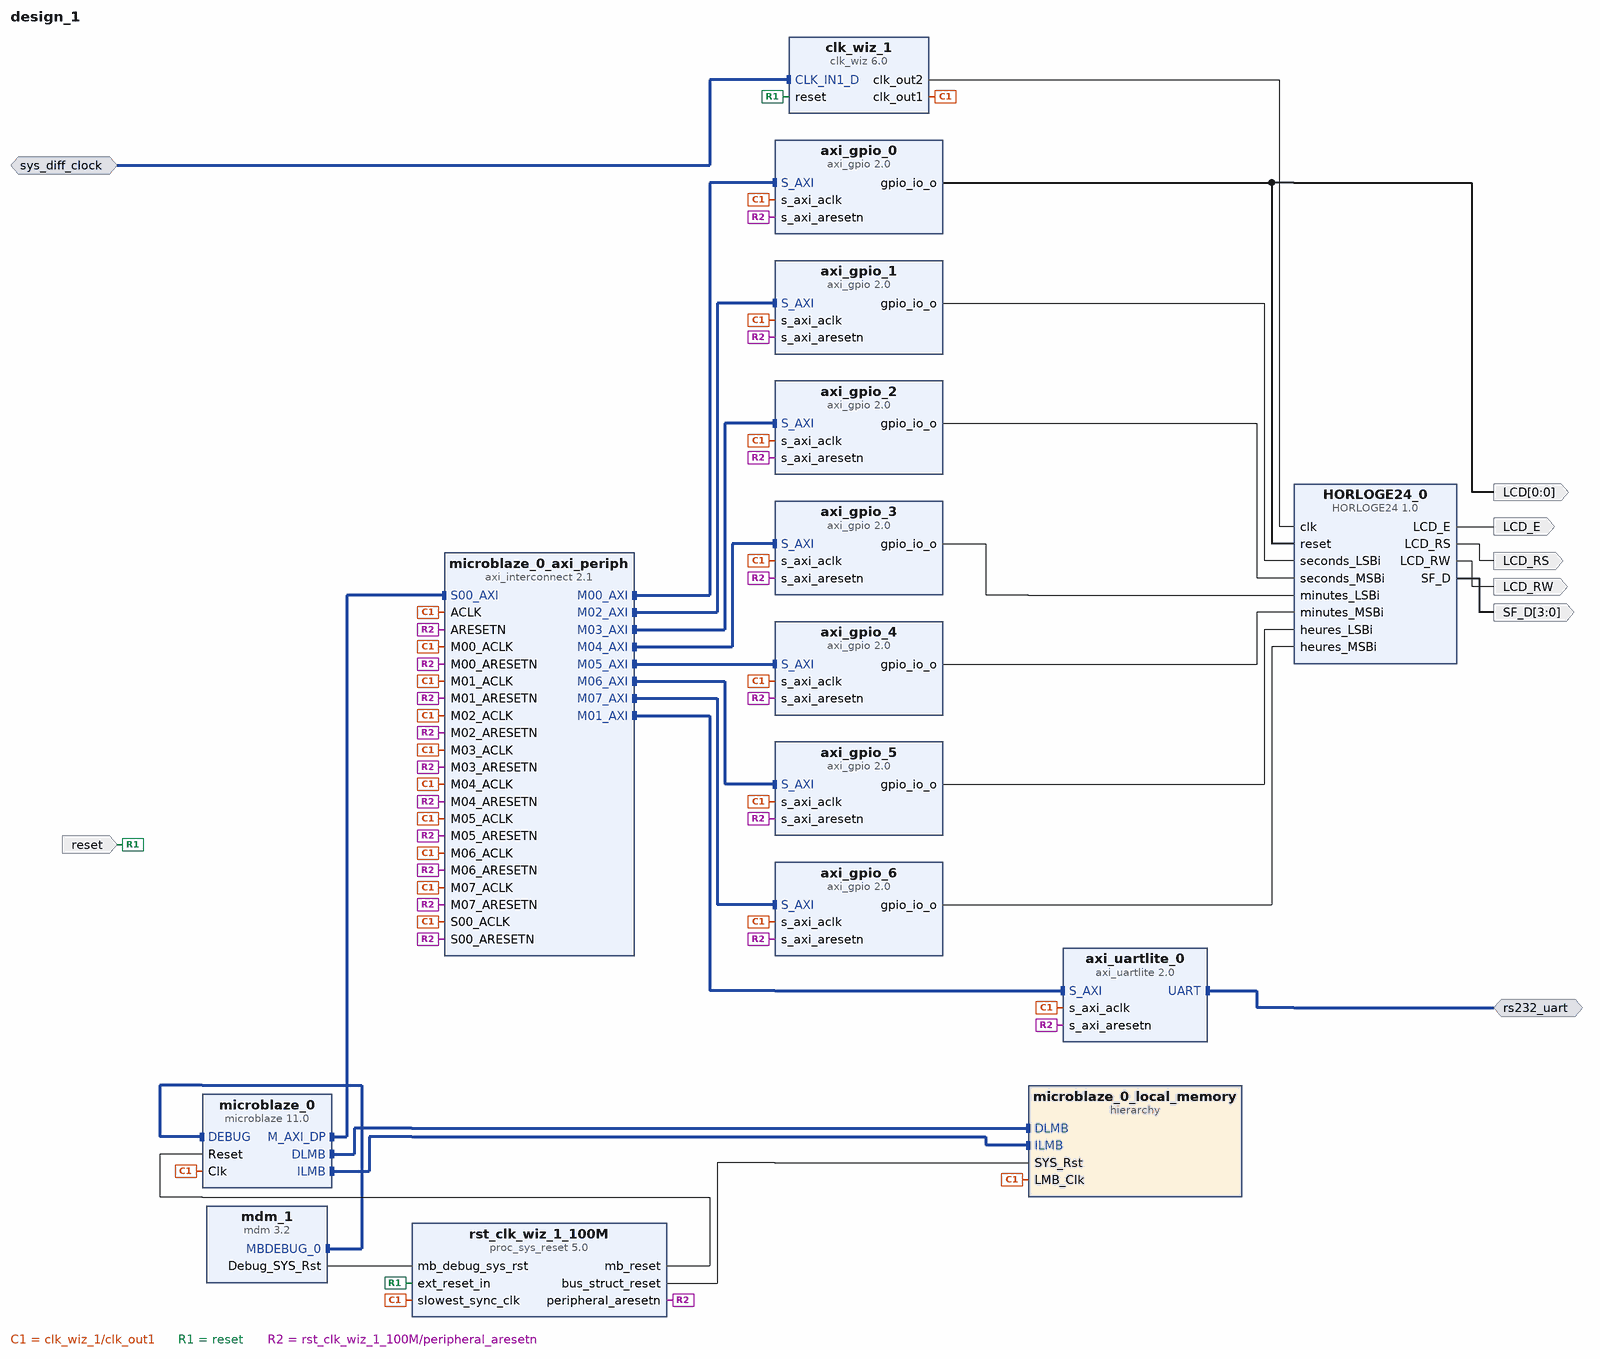
[diagram p0: block diagram of the top level]
# Vivado block design design_1, xc7k325tffg900-2, Vivado 2021.2
create_bd_design design_1

create_bd_intf_port -mode Master -vlnv xilinx.com:interface:uart_rtl:1.0 rs232_uart
create_bd_intf_port -mode Slave -vlnv xilinx.com:interface:diff_clock_rtl:1.0 sys_diff_clock
set_property -dict {CONFIG.FREQ_HZ 200000000} [get_bd_intf_ports sys_diff_clock]
create_bd_port -dir I -type rst reset
set_property -dict {CONFIG.POLARITY ACTIVE_HIGH} [get_bd_ports reset]
create_bd_port -dir O -from 0 -to 0 LCD
create_bd_port -dir O -from 3 -to 0 SF_D
create_bd_port -dir O LCD_E
create_bd_port -dir O LCD_RS
create_bd_port -dir O LCD_RW

create_bd_cell -type ip -vlnv xilinx.com:ip:microblaze:11.0 microblaze_0
set_property -dict [list \
  CONFIG.C_DEBUG_ENABLED 1 \
  CONFIG.C_D_AXI 1 \
  CONFIG.C_D_LMB 1 \
  CONFIG.C_I_LMB 1 \
  CONFIG.G_TEMPLATE_LIST 8 \
] [get_bd_cells microblaze_0]
create_bd_cell -type ip -vlnv xilinx.com:ip:axi_uartlite:2.0 axi_uartlite_0
set_property -dict {CONFIG.UARTLITE_BOARD_INTERFACE rs232_uart CONFIG.USE_BOARD_FLOW true} [get_bd_cells axi_uartlite_0]
create_bd_cell -type ip -vlnv xilinx.com:ip:axi_gpio:2.0 axi_gpio_0
set_property -dict {CONFIG.C_ALL_OUTPUTS 1 CONFIG.C_GPIO_WIDTH 1} [get_bd_cells axi_gpio_0]
create_bd_cell -type hier microblaze_0_local_memory
create_bd_cell -type ip -vlnv xilinx.com:ip:mdm:3.2 mdm_1
create_bd_cell -type ip -vlnv xilinx.com:ip:clk_wiz:6.0 clk_wiz_1
set_property -dict [list \
  CONFIG.CLKOUT2_JITTER 129.198 \
  CONFIG.CLKOUT2_PHASE_ERROR 89.971 \
  CONFIG.CLKOUT2_REQUESTED_OUT_FREQ 50 \
  CONFIG.CLKOUT2_USED true \
  CONFIG.CLK_IN1_BOARD_INTERFACE sys_diff_clock \
  CONFIG.MMCM_CLKOUT1_DIVIDE 20 \
  CONFIG.NUM_OUT_CLKS 2 \
  CONFIG.PRIM_SOURCE Differential_clock_capable_pin \
  CONFIG.RESET_BOARD_INTERFACE reset \
  CONFIG.USE_BOARD_FLOW true \
  CONFIG.USE_LOCKED false \
] [get_bd_cells clk_wiz_1]
create_bd_cell -type ip -vlnv xilinx.com:ip:proc_sys_reset:5.0 rst_clk_wiz_1_100M
set_property -dict {CONFIG.RESET_BOARD_INTERFACE reset CONFIG.USE_BOARD_FLOW true} [get_bd_cells rst_clk_wiz_1_100M]
create_bd_cell -type ip -vlnv xilinx.com:ip:axi_interconnect:2.1 microblaze_0_axi_periph
set_property -dict {CONFIG.NUM_MI 8} [get_bd_cells microblaze_0_axi_periph]
create_bd_cell -type ip -vlnv xilinx.com:ip:axi_gpio:2.0 axi_gpio_1
set_property -dict {CONFIG.C_ALL_OUTPUTS 1 CONFIG.C_GPIO_WIDTH 4} [get_bd_cells axi_gpio_1]
create_bd_cell -type ip -vlnv xilinx.com:ip:axi_gpio:2.0 axi_gpio_2
set_property -dict {CONFIG.C_ALL_OUTPUTS 1 CONFIG.C_GPIO_WIDTH 4} [get_bd_cells axi_gpio_2]
create_bd_cell -type ip -vlnv xilinx.com:ip:axi_gpio:2.0 axi_gpio_3
set_property -dict {CONFIG.C_ALL_OUTPUTS 1 CONFIG.C_GPIO_WIDTH 4} [get_bd_cells axi_gpio_3]
create_bd_cell -type ip -vlnv xilinx.com:ip:axi_gpio:2.0 axi_gpio_4
set_property -dict {CONFIG.C_ALL_OUTPUTS 1 CONFIG.C_GPIO_WIDTH 4} [get_bd_cells axi_gpio_4]
create_bd_cell -type ip -vlnv xilinx.com:ip:axi_gpio:2.0 axi_gpio_5
set_property -dict {CONFIG.C_ALL_OUTPUTS 1 CONFIG.C_GPIO_WIDTH 4} [get_bd_cells axi_gpio_5]
create_bd_cell -type ip -vlnv xilinx.com:ip:axi_gpio:2.0 axi_gpio_6
set_property -dict {CONFIG.C_ALL_OUTPUTS 1 CONFIG.C_GPIO_WIDTH 4} [get_bd_cells axi_gpio_6]
create_bd_cell -type ip -vlnv in2p3.fr:user:HORLOGE24:1.0 HORLOGE24_0

# ---- hierarchy /microblaze_0_local_memory ----
current_bd_instance /microblaze_0_local_memory
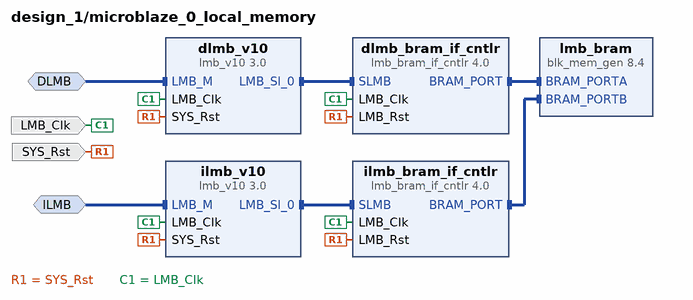
[diagram p1: block diagram inside /microblaze_0_local_memory]
create_bd_intf_pin -mode MirroredMaster -vlnv xilinx.com:interface:lmb_rtl:1.0 DLMB
create_bd_intf_pin -mode MirroredMaster -vlnv xilinx.com:interface:lmb_rtl:1.0 ILMB
create_bd_pin -dir I -type clk LMB_Clk
create_bd_pin -dir I -type rst SYS_Rst

create_bd_cell -type ip -vlnv xilinx.com:ip:lmb_v10:3.0 dlmb_v10
create_bd_cell -type ip -vlnv xilinx.com:ip:lmb_v10:3.0 ilmb_v10
create_bd_cell -type ip -vlnv xilinx.com:ip:lmb_bram_if_cntlr:4.0 dlmb_bram_if_cntlr
set_property -dict {CONFIG.C_ECC 0} [get_bd_cells dlmb_bram_if_cntlr]
create_bd_cell -type ip -vlnv xilinx.com:ip:lmb_bram_if_cntlr:4.0 ilmb_bram_if_cntlr
set_property -dict {CONFIG.C_ECC 0} [get_bd_cells ilmb_bram_if_cntlr]
create_bd_cell -type ip -vlnv xilinx.com:ip:blk_mem_gen:8.4 lmb_bram
set_property -dict {CONFIG.Memory_Type True_Dual_Port_RAM CONFIG.use_bram_block BRAM_Controller} [get_bd_cells lmb_bram]

# ---- connections ----

current_bd_instance /microblaze_0_local_memory
connect_bd_intf_net -intf_net microblaze_0_dlmb [get_bd_intf_pins DLMB] [get_bd_intf_pins dlmb_v10/LMB_M]
connect_bd_intf_net -intf_net microblaze_0_dlmb_bus [get_bd_intf_pins dlmb_v10/LMB_Sl_0] [get_bd_intf_pins dlmb_bram_if_cntlr/SLMB]
connect_bd_intf_net -intf_net microblaze_0_dlmb_cntlr [get_bd_intf_pins dlmb_bram_if_cntlr/BRAM_PORT] [get_bd_intf_pins lmb_bram/BRAM_PORTA]
connect_bd_intf_net -intf_net microblaze_0_ilmb [get_bd_intf_pins ILMB] [get_bd_intf_pins ilmb_v10/LMB_M]
connect_bd_intf_net -intf_net microblaze_0_ilmb_bus [get_bd_intf_pins ilmb_v10/LMB_Sl_0] [get_bd_intf_pins ilmb_bram_if_cntlr/SLMB]
connect_bd_intf_net -intf_net microblaze_0_ilmb_cntlr [get_bd_intf_pins ilmb_bram_if_cntlr/BRAM_PORT] [get_bd_intf_pins lmb_bram/BRAM_PORTB]
connect_bd_net [get_bd_pins SYS_Rst] \
  [get_bd_pins dlmb_v10/SYS_Rst] [get_bd_pins dlmb_bram_if_cntlr/LMB_Rst] [get_bd_pins ilmb_v10/SYS_Rst] \
  [get_bd_pins ilmb_bram_if_cntlr/LMB_Rst]
connect_bd_net -net microblaze_0_Clk [get_bd_pins LMB_Clk] \
  [get_bd_pins dlmb_v10/LMB_Clk] [get_bd_pins dlmb_bram_if_cntlr/LMB_Clk] [get_bd_pins ilmb_v10/LMB_Clk] \
  [get_bd_pins ilmb_bram_if_cntlr/LMB_Clk]
set_property HDL_ATTRIBUTE.BMM_INFO_ADDRESS_SPACE {byte  0x00000000 32 > design_1 microblaze_0_local_memory/lmb_bram} [get_bd_cells dlmb_bram_if_cntlr]
set_property HDL_ATTRIBUTE.KEEP_HIERARCHY yes [get_bd_cells dlmb_bram_if_cntlr]

current_bd_instance /
connect_bd_intf_net [get_bd_intf_ports rs232_uart] [get_bd_intf_pins axi_uartlite_0/UART]
connect_bd_intf_net [get_bd_intf_pins microblaze_0/M_AXI_DP] [get_bd_intf_pins microblaze_0_axi_periph/S00_AXI]
connect_bd_intf_net [get_bd_intf_pins microblaze_0_axi_periph/M00_AXI] [get_bd_intf_pins axi_gpio_0/S_AXI]
connect_bd_intf_net [get_bd_intf_pins microblaze_0_axi_periph/M01_AXI] [get_bd_intf_pins axi_uartlite_0/S_AXI]
connect_bd_intf_net [get_bd_intf_pins microblaze_0_axi_periph/M02_AXI] [get_bd_intf_pins axi_gpio_1/S_AXI]
connect_bd_intf_net [get_bd_intf_pins microblaze_0_axi_periph/M03_AXI] [get_bd_intf_pins axi_gpio_2/S_AXI]
connect_bd_intf_net [get_bd_intf_pins microblaze_0_axi_periph/M04_AXI] [get_bd_intf_pins axi_gpio_3/S_AXI]
connect_bd_intf_net [get_bd_intf_pins microblaze_0_axi_periph/M05_AXI] [get_bd_intf_pins axi_gpio_4/S_AXI]
connect_bd_intf_net [get_bd_intf_pins microblaze_0_axi_periph/M06_AXI] [get_bd_intf_pins axi_gpio_5/S_AXI]
connect_bd_intf_net [get_bd_intf_pins microblaze_0_axi_periph/M07_AXI] [get_bd_intf_pins axi_gpio_6/S_AXI]
connect_bd_intf_net [get_bd_intf_pins mdm_1/MBDEBUG_0] [get_bd_intf_pins microblaze_0/DEBUG]
connect_bd_intf_net [get_bd_intf_pins microblaze_0/DLMB] [get_bd_intf_pins microblaze_0_local_memory/DLMB]
connect_bd_intf_net [get_bd_intf_pins microblaze_0/ILMB] [get_bd_intf_pins microblaze_0_local_memory/ILMB]
connect_bd_intf_net [get_bd_intf_ports sys_diff_clock] [get_bd_intf_pins clk_wiz_1/CLK_IN1_D]
connect_bd_net [get_bd_pins HORLOGE24_0/LCD_E] [get_bd_ports LCD_E]
connect_bd_net [get_bd_pins HORLOGE24_0/LCD_RS] [get_bd_ports LCD_RS]
connect_bd_net [get_bd_pins HORLOGE24_0/LCD_RW] [get_bd_ports LCD_RW]
connect_bd_net [get_bd_pins HORLOGE24_0/SF_D] [get_bd_ports SF_D]
connect_bd_net [get_bd_pins axi_gpio_0/gpio_io_o] [get_bd_ports LCD] [get_bd_pins HORLOGE24_0/reset]
connect_bd_net [get_bd_pins axi_gpio_1/gpio_io_o] [get_bd_pins HORLOGE24_0/seconds_LSBi]
connect_bd_net [get_bd_pins axi_gpio_2/gpio_io_o] [get_bd_pins HORLOGE24_0/seconds_MSBi]
connect_bd_net [get_bd_pins axi_gpio_3/gpio_io_o] [get_bd_pins HORLOGE24_0/minutes_LSBi]
connect_bd_net [get_bd_pins axi_gpio_4/gpio_io_o] [get_bd_pins HORLOGE24_0/minutes_MSBi]
connect_bd_net [get_bd_pins axi_gpio_5/gpio_io_o] [get_bd_pins HORLOGE24_0/heures_LSBi]
connect_bd_net [get_bd_pins axi_gpio_6/gpio_io_o] [get_bd_pins HORLOGE24_0/heures_MSBi]
connect_bd_net [get_bd_pins clk_wiz_1/clk_out2] [get_bd_pins HORLOGE24_0/clk]
connect_bd_net [get_bd_pins mdm_1/Debug_SYS_Rst] [get_bd_pins rst_clk_wiz_1_100M/mb_debug_sys_rst]
connect_bd_net -net microblaze_0_Clk [get_bd_pins clk_wiz_1/clk_out1] \
  [get_bd_pins microblaze_0/Clk] [get_bd_pins microblaze_0_local_memory/LMB_Clk] \
  [get_bd_pins rst_clk_wiz_1_100M/slowest_sync_clk] [get_bd_pins microblaze_0_axi_periph/S00_ACLK] \
  [get_bd_pins axi_gpio_0/s_axi_aclk] [get_bd_pins microblaze_0_axi_periph/M00_ACLK] \
  [get_bd_pins microblaze_0_axi_periph/ACLK] [get_bd_pins axi_uartlite_0/s_axi_aclk] \
  [get_bd_pins microblaze_0_axi_periph/M01_ACLK] [get_bd_pins axi_gpio_1/s_axi_aclk] \
  [get_bd_pins microblaze_0_axi_periph/M02_ACLK] [get_bd_pins axi_gpio_2/s_axi_aclk] \
  [get_bd_pins microblaze_0_axi_periph/M03_ACLK] [get_bd_pins axi_gpio_3/s_axi_aclk] \
  [get_bd_pins microblaze_0_axi_periph/M04_ACLK] [get_bd_pins axi_gpio_4/s_axi_aclk] \
  [get_bd_pins microblaze_0_axi_periph/M05_ACLK] [get_bd_pins axi_gpio_5/s_axi_aclk] \
  [get_bd_pins microblaze_0_axi_periph/M06_ACLK] [get_bd_pins axi_gpio_6/s_axi_aclk] \
  [get_bd_pins microblaze_0_axi_periph/M07_ACLK]
connect_bd_net [get_bd_ports reset] [get_bd_pins clk_wiz_1/reset] [get_bd_pins rst_clk_wiz_1_100M/ext_reset_in]
connect_bd_net [get_bd_pins rst_clk_wiz_1_100M/bus_struct_reset] [get_bd_pins microblaze_0_local_memory/SYS_Rst]
connect_bd_net [get_bd_pins rst_clk_wiz_1_100M/mb_reset] [get_bd_pins microblaze_0/Reset]
connect_bd_net [get_bd_pins rst_clk_wiz_1_100M/peripheral_aresetn] \
  [get_bd_pins microblaze_0_axi_periph/S00_ARESETN] [get_bd_pins axi_gpio_0/s_axi_aresetn] \
  [get_bd_pins microblaze_0_axi_periph/M00_ARESETN] [get_bd_pins microblaze_0_axi_periph/ARESETN] \
  [get_bd_pins axi_uartlite_0/s_axi_aresetn] [get_bd_pins microblaze_0_axi_periph/M01_ARESETN] \
  [get_bd_pins axi_gpio_1/s_axi_aresetn] [get_bd_pins microblaze_0_axi_periph/M02_ARESETN] \
  [get_bd_pins axi_gpio_2/s_axi_aresetn] [get_bd_pins microblaze_0_axi_periph/M03_ARESETN] \
  [get_bd_pins axi_gpio_3/s_axi_aresetn] [get_bd_pins microblaze_0_axi_periph/M04_ARESETN] \
  [get_bd_pins axi_gpio_4/s_axi_aresetn] [get_bd_pins microblaze_0_axi_periph/M05_ARESETN] \
  [get_bd_pins axi_gpio_5/s_axi_aresetn] [get_bd_pins microblaze_0_axi_periph/M06_ARESETN] \
  [get_bd_pins axi_gpio_6/s_axi_aresetn] [get_bd_pins microblaze_0_axi_periph/M07_ARESETN]
set_property HDL_ATTRIBUTE.BMM_INFO_PROCESSOR {microblaze-le > design_1 microblaze_0_local_memory/dlmb_bram_if_cntlr} [get_bd_cells microblaze_0]
set_property HDL_ATTRIBUTE.KEEP_HIERARCHY yes [get_bd_cells microblaze_0]

# ---- address map ----
assign_bd_address -offset 0x00000000 -range 8K -target_address_space [get_bd_addr_spaces microblaze_0/Data] [get_bd_addr_segs microblaze_0_local_memory/dlmb_bram_if_cntlr/SLMB/Mem]
assign_bd_address -offset 0x40000000 -range 64K -target_address_space [get_bd_addr_spaces microblaze_0/Data] [get_bd_addr_segs axi_gpio_0/S_AXI/Reg]
assign_bd_address -offset 0x40010000 -range 64K -target_address_space [get_bd_addr_spaces microblaze_0/Data] [get_bd_addr_segs axi_gpio_1/S_AXI/Reg]
assign_bd_address -offset 0x40020000 -range 64K -target_address_space [get_bd_addr_spaces microblaze_0/Data] [get_bd_addr_segs axi_gpio_2/S_AXI/Reg]
assign_bd_address -offset 0x40030000 -range 64K -target_address_space [get_bd_addr_spaces microblaze_0/Data] [get_bd_addr_segs axi_gpio_3/S_AXI/Reg]
assign_bd_address -offset 0x40040000 -range 64K -target_address_space [get_bd_addr_spaces microblaze_0/Data] [get_bd_addr_segs axi_gpio_4/S_AXI/Reg]
assign_bd_address -offset 0x40050000 -range 64K -target_address_space [get_bd_addr_spaces microblaze_0/Data] [get_bd_addr_segs axi_gpio_5/S_AXI/Reg]
assign_bd_address -offset 0x40060000 -range 64K -target_address_space [get_bd_addr_spaces microblaze_0/Data] [get_bd_addr_segs axi_gpio_6/S_AXI/Reg]
assign_bd_address -offset 0x40600000 -range 64K -target_address_space [get_bd_addr_spaces microblaze_0/Data] [get_bd_addr_segs axi_uartlite_0/S_AXI/Reg]
assign_bd_address -offset 0x00000000 -range 8K -target_address_space [get_bd_addr_spaces microblaze_0/Instruction] [get_bd_addr_segs microblaze_0_local_memory/ilmb_bram_if_cntlr/SLMB/Mem]

validate_bd_design
save_bd_design
